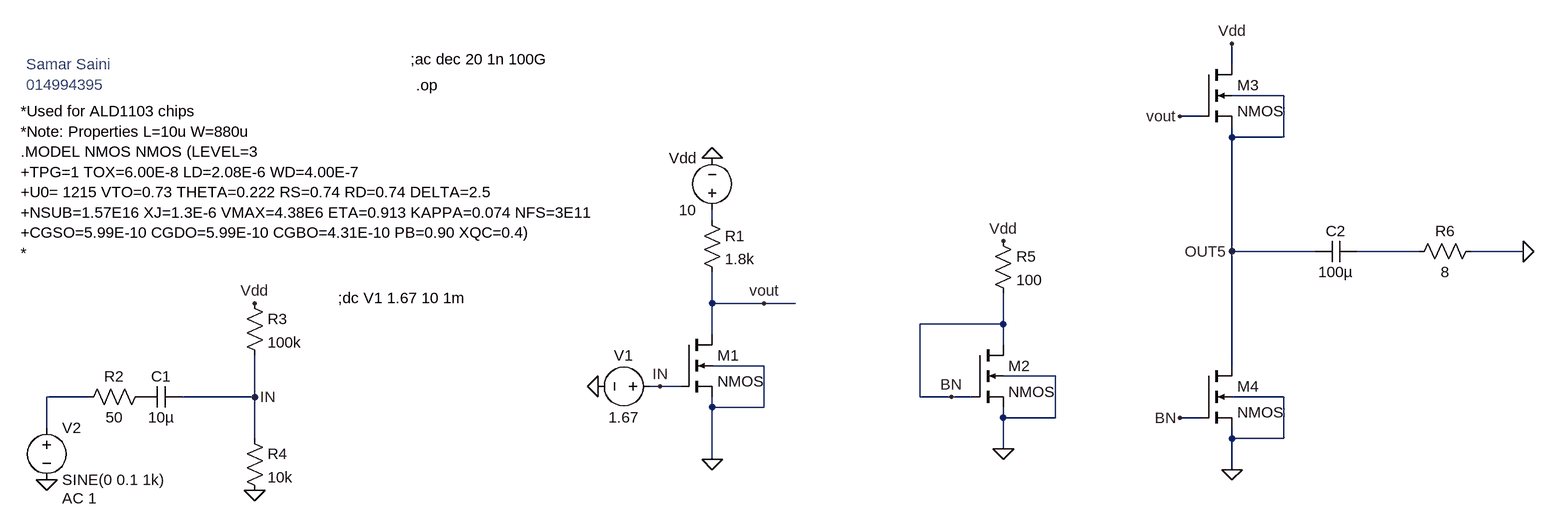
[diagram p0: schematic Draft9.asc]
Draft9.asc, the LTspice schematic file:
Version 4
SHEET 1 1620 680
WIRE 1152 -208 1152 -240
WIRE 1232 -160 1152 -160
WIRE 1104 -128 1072 -128
WIRE 1152 -96 1152 -112
WIRE 1232 -96 1232 -160
WIRE 1232 -96 1152 -96
WIRE 352 32 352 16
WIRE 1152 80 1152 -96
WIRE 1280 80 1152 80
WIRE 1440 80 1344 80
WIRE 1600 80 1520 80
WIRE 352 160 352 112
WIRE 432 160 352 160
WIRE 480 160 432 160
WIRE 800 192 800 144
WIRE 800 192 672 192
WIRE 352 208 352 160
WIRE 800 224 800 192
WIRE 432 256 352 256
WIRE 1152 256 1152 80
WIRE 880 272 800 272
WIRE 272 288 256 288
WIRE 304 288 272 288
WIRE -608 304 -672 304
WIRE -352 304 -352 240
WIRE -352 304 -464 304
WIRE 672 304 672 192
WIRE 720 304 672 304
WIRE 752 304 720 304
WIRE 1232 304 1152 304
WIRE 352 320 352 304
WIRE 432 320 432 256
WIRE 432 320 352 320
WIRE 800 336 800 320
WIRE 880 336 880 272
WIRE 880 336 800 336
WIRE 1104 336 1072 336
WIRE -672 352 -672 304
WIRE -352 368 -352 304
WIRE 1152 368 1152 352
WIRE 1232 368 1232 304
WIRE 1232 368 1152 368
WIRE 800 384 800 336
WIRE 352 400 352 320
WIRE 1152 416 1152 368
FLAG 352 400 0
FLAG 272 288 IN
FLAG 176 288 0
FLAG 352 -64 0
FLAG 432 160 vout
FLAG -672 432 0
FLAG -352 448 0
FLAG -352 160 Vdd
FLAG -352 304 IN
FLAG 720 304 BN
FLAG 800 64 Vdd
FLAG 800 384 0
FLAG 1072 -128 vout
FLAG 1152 -240 Vdd
FLAG 1072 336 BN
FLAG 1152 416 0
FLAG 1600 80 0
FLAG 1152 80 OUT5
SYMBOL nmos4 304 208 R0
SYMATTR InstName M1
SYMATTR Value2 l=10u w=880u ad=26400p as=26400p pd=1820u ps=1820u
SYMBOL voltage 352 32 R180
WINDOW 0 24 96 Left 2
WINDOW 3 24 16 Left 2
SYMATTR InstName Vdd
SYMATTR Value 10
SYMBOL voltage 272 288 R90
WINDOW 0 -32 56 VBottom 2
WINDOW 3 32 56 VTop 2
SYMATTR InstName V1
SYMATTR Value 1.67
SYMBOL res 336 16 R0
SYMATTR InstName R1
SYMATTR Value 1.8k
SYMBOL voltage -672 336 R0
WINDOW 123 24 124 Left 2
WINDOW 39 0 0 Left 0
SYMATTR InstName V2
SYMATTR Value SINE(0 0.1 1k)
SYMATTR Value2 AC 1
SYMBOL res -512 288 R90
WINDOW 0 0 56 VBottom 2
WINDOW 3 32 56 VTop 2
SYMATTR InstName R2
SYMATTR Value 50
SYMBOL cap -464 288 R90
WINDOW 0 0 32 VBottom 2
WINDOW 3 32 32 VTop 2
SYMATTR InstName C1
SYMATTR Value 10µ
SYMBOL res -368 144 R0
SYMATTR InstName R3
SYMATTR Value 100k
SYMBOL res -368 352 R0
SYMATTR InstName R4
SYMATTR Value 10k
SYMBOL nmos4 752 224 R0
SYMATTR InstName M2
SYMATTR Value2 l=10u w=880u ad=26400p as=26400p pd=1820u ps=1820u
SYMBOL res 784 48 R0
SYMATTR InstName R5
SYMATTR Value 100
SYMBOL nmos4 1104 -208 R0
SYMATTR InstName M3
SYMATTR Value2 l=10u w=880u ad=26400p as=26400p pd=1820u ps=1820u
SYMBOL nmos4 1104 256 R0
SYMATTR InstName M4
SYMATTR Value2 l=10u w=880u ad=26400p as=26400p pd=1820u ps=1820u
SYMBOL cap 1344 64 R90
WINDOW 0 0 32 VBottom 2
WINDOW 3 32 32 VTop 2
SYMATTR InstName C2
SYMATTR Value 100µ
SYMBOL res 1536 64 R90
WINDOW 0 0 56 VBottom 2
WINDOW 3 32 56 VTop 2
SYMATTR InstName R6
SYMATTR Value 8
TEXT -712 -136 Left 2 !*Used for ALD1103 chips\n*Note: Properties L=10u W=880u\n.MODEL NMOS NMOS (LEVEL=3 \n+TPG=1 TOX=6.00E-8 LD=2.08E-6 WD=4.00E-7\n+U0= 1215 VTO=0.73 THETA=0.222 RS=0.74 RD=0.74 DELTA=2.5 \n+NSUB=1.57E16 XJ=1.3E-6 VMAX=4.38E6 ETA=0.913 KAPPA=0.074 NFS=3E11\n+CGSO=5.99E-10 CGDO=5.99E-10 CGBO=4.31E-10 PB=0.90 XQC=0.4)\n*
TEXT -224 152 Left 2 !;dc V1 1.67 10 1m
TEXT -704 -208 Left 2 ;Samar Saini\n014994395
TEXT -112 -216 Left 2 !;ac dec 20 1n 100G
TEXT -104 -176 Left 2 !.op

The netlist it stands for:
* Draft9.asc
M1 vout IN 0 0 NMOS l=10u w=880u ad=26400p as=26400p pd=1820u ps=1820u
Vdd N001 0 10
V1 IN 0 1.67
R1 N001 vout 1.8k
V2 N003 0 SINE(0 0.1 1k) AC 1
R2 P001 N003 50
C1 IN P001 10µ
R3 Vdd IN 100k
R4 IN 0 10k
M2 BN BN 0 0 NMOS l=10u w=880u ad=26400p as=26400p pd=1820u ps=1820u
R5 Vdd BN 100
M3 Vdd vout OUT5 OUT5 NMOS l=10u w=880u ad=26400p as=26400p pd=1820u ps=1820u
M4 OUT5 BN 0 0 NMOS l=10u w=880u ad=26400p as=26400p pd=1820u ps=1820u
C2 N002 OUT5 100µ
R6 0 N002 8
.model NMOS NMOS
.model PMOS PMOS
.lib standard.mos
*Used for ALD1103 chips
*Note: Properties L=10u W=880u
.MODEL NMOS NMOS (LEVEL=3
+TPG=1 TOX=6.00E-8 LD=2.08E-6 WD=4.00E-7
+U0= 1215 VTO=0.73 THETA=0.222 RS=0.74 RD=0.74 DELTA=2.5
+NSUB=1.57E16 XJ=1.3E-6 VMAX=4.38E6 ETA=0.913 KAPPA=0.074 NFS=3E11
+CGSO=5.99E-10 CGDO=5.99E-10 CGBO=4.31E-10 PB=0.90 XQC=0.4)
*
;dc V1 1.67 10 1m
* Samar Saini
* 014994395
;ac dec 20 1n 100G
.op
.backanno
.end